# Altium project STM32F072_Platform.PrjPcb
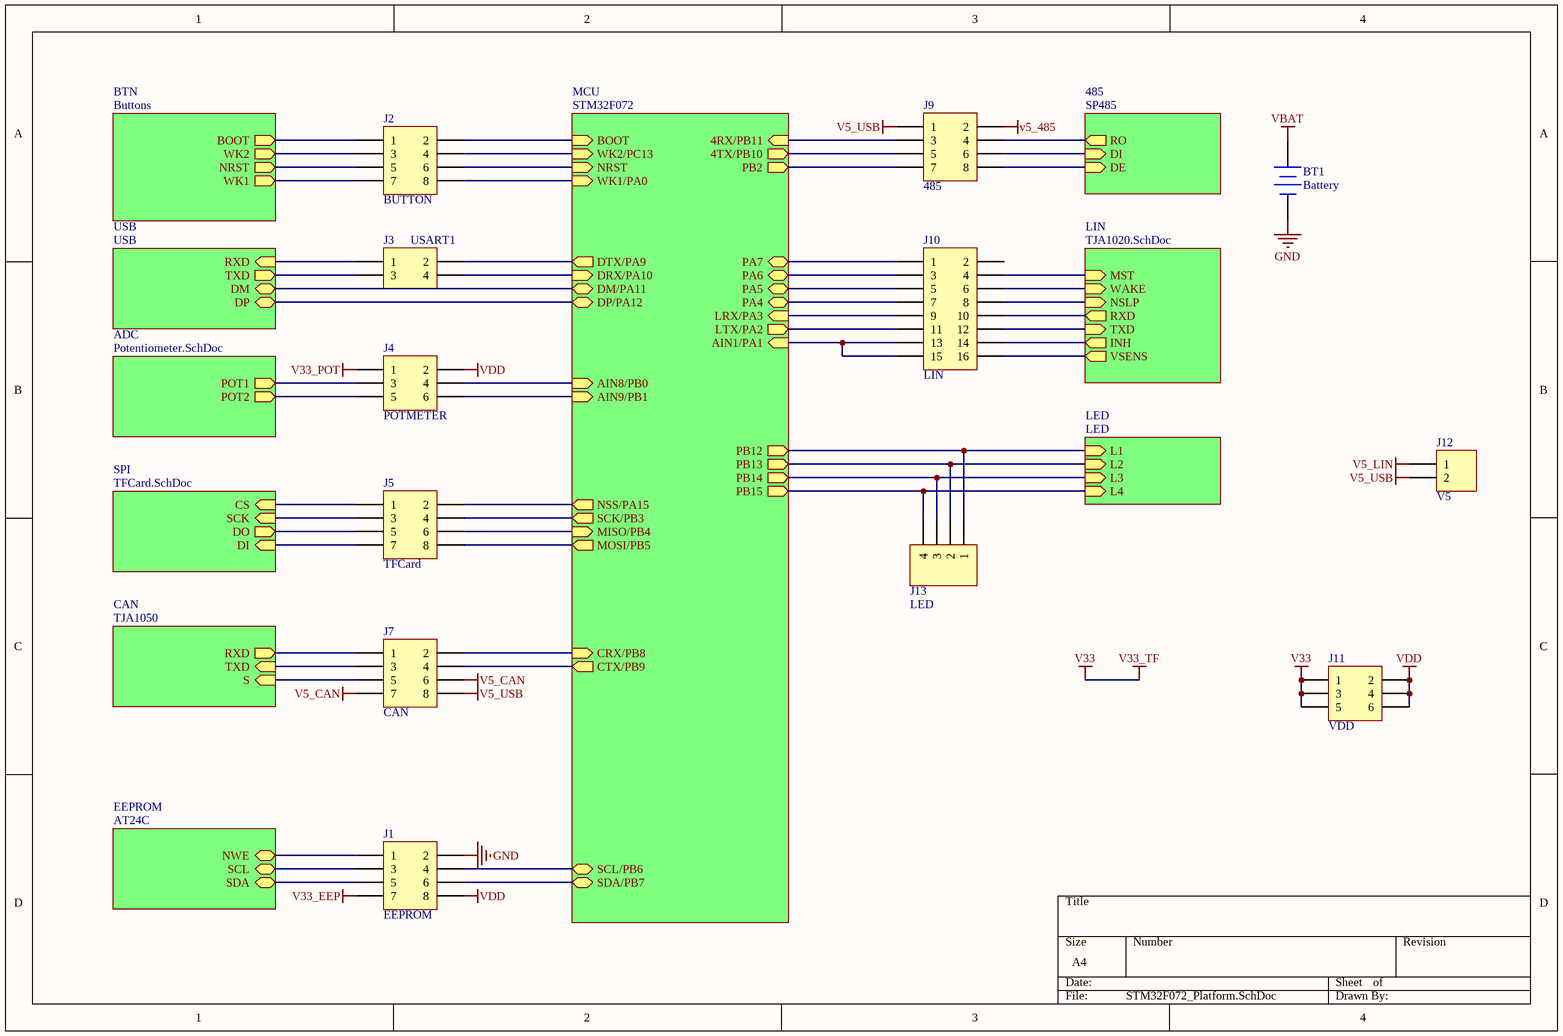
[diagram p0: STM32F072_Platform.SchDoc]
11 sheets, 126 parts. Net scope: hierarchical (ports join the sheet entries above them; power ports are global).
Board files: Outline.PcbDoc, PCB_A0.PcbDoc
Sheets:
  STM32F072_Platform.SchDoc
    MCU = STM32F072.SchDoc
    485 = SP485.SchDoc
    CAN = TJA1050.SchDoc
    SPI = TFCard.SchDoc
    EEPROM = AT24C.SchDoc
    BTN = Buttons.SchDoc
    USB = USB.SchDoc
    ADC = Potentiometer.SchDoc
    LIN = TJA1020.SchDoc
    LED = LED.SchDoc

## Sheet STM32F072_Platform.SchDoc
size A4

### Parts
BT1  Battery  [CR1220]
J1  EEPROM  [HDR2X4]
J2  BUTTON  [HDR2X4]
J3  USART1  [HDR2X2]
J4  POTMETER  [HDR2X3]
J5  TFCard  [HDR2X4]
J7  CAN  [HDR2X4]
J9  485  [HDR2X4]
J10  LIN  [HDR2X8]
J11  VDD  [HDR2X3]
J12  V5  [HDR1X2]
J13  LED  [HDR2X2]

### Sub-sheets
485 = SP485: RO (out), DI (in), DE (in)
ADC = Potentiometer.SchDoc: POT1 (out), POT2 (out)
BTN = Buttons: NRST (out), BOOT (out), WK1 (out), WK2 (out)
CAN = TJA1050: S (in), TXD (in), RXD (out)
EEPROM = AT24C: SCL, SDA, NWE
LED = LED: L1 (in), L2 (in), L3 (in), L4 (in)
LIN = TJA1020.SchDoc: TXD (in), RXD (out), NSLP (in), WAKE (in), INH (out), MST (in), VSENS (out)
MCU = STM32F072: SCL/PB6, SDA/PB7, NRST (in), BOOT (in), WK1/PA0 (in), WK2/PC13 (in), DM/PA11, DP/PA12, DRX/PA10 (in), DTX/PA9 (out), AIN8/PB0 (in), AIN9/PB1 (in), NSS/PA15 (out), SCK/PB3 (out), MOSI/PB5 (out), MISO/PB4 (in), CTX/PB9 (out), CRX/PB8 (in), 4TX/PB10 (out), 4RX/PB11 (in), LTX/PA2 (out), LRX/PA3 (in), PA4, AIN1/PA1 (in), PA5, PA6, PA7, PB2 (out), PB12 (out), PB13 (out), PB14 (out), PB15 (out)
SPI = TFCard.SchDoc: CS (in), SCK (in), DI (in), DO (out)
USB = USB: DM, DP, TXD (out), RXD (in)

### Nets
GND: BT1.2(-) J1.2
v5_485: J9.2
V5_CAN: J7.6 J7.7
V5_LIN: J12.1
V5_USB: J7.8 J9.1 J12.2
V33: J11.1 J11.3 J11.5  [also labelled V33_TF]
V33_EEP: J1.7
V33_POT: J4.1
VBAT: BT1.1(+)
VDD: J1.8 J4.2 J11.2 J11.4 J11.6
485_RX/PB11: J9.3 ; sheet MCU/4RX/PB11
485_TX/PB10: J9.5 ; sheet MCU/4TX/PB10
ADC_IN8/PB0: J4.4 ; sheet MCU/AIN8/PB0
ADC_IN9/PB1: J4.6 ; sheet MCU/AIN9/PB1
BOOT: J2.1 ; sheet BTN/BOOT
BOOT0: J2.2 ; sheet MCU/BOOT
CAN_RX/PB8: J7.2 ; sheet MCU/CRX/PB8
CAN_RXD: J7.1 ; sheet CAN/RXD
CAN_TX/PB9: J7.4 ; sheet MCU/CTX/PB9
CAN_TXD: J7.3 ; sheet CAN/TXD
CS: J5.1 ; sheet SPI/CS
DBG_RX/PA10: J3.4 ; sheet MCU/DRX/PA10
DBG_TX/PA9: J3.2 ; sheet MCU/DTX/PA9
DI: J5.7 ; sheet SPI/DI
DM: sheet MCU/DM/PA11, sheet USB/DM
DO: J5.5 ; sheet SPI/DO
DP: sheet MCU/DP/PA12, sheet USB/DP
EEP_SCL/PB6: J1.4 ; sheet MCU/SCL/PB6
EEP_SDA/PB7: J1.6 ; sheet MCU/SDA/PB7
LIN_RX/PA3: J10.9 ; sheet MCU/LRX/PA3
LIN_TX/PA2: J10.11 ; sheet MCU/LTX/PA2
NRST: J2.6 ; sheet MCU/NRST
NSLP: J10.8 ; sheet LIN/NSLP
NWE: J1.1 ; sheet EEPROM/NWE
PA1: J10.13 J10.15 ; sheet MCU/AIN1/PA1
PA4: J10.7 ; sheet MCU/PA4
PA5: J10.5 ; sheet MCU/PA5
PA6: J10.3 ; sheet MCU/PA6
PA7: J10.1 ; sheet MCU/PA7
PB2: J9.7 ; sheet MCU/PB2
PB12: J13.1 ; sheet MCU/PB12, sheet LED/L1
PB13: J13.2 ; sheet MCU/PB13, sheet LED/L2
PB14: J13.3 ; sheet MCU/PB14, sheet LED/L3
PB15: J13.4 ; sheet MCU/PB15, sheet LED/L4
RESET: J2.5 ; sheet BTN/NRST
S: J7.5 ; sheet CAN/S
SCK: J5.3 ; sheet SPI/SCK
SCL: J1.3 ; sheet EEPROM/SCL
SDA: J1.5 ; sheet EEPROM/SDA
SPI_MISO/PB4: J5.6 ; sheet MCU/MISO/PB4
SPI_MOSI/PB5: J5.8 ; sheet MCU/MOSI/PB5
SPI_NSS/PA15: J5.2 ; sheet MCU/NSS/PA15
SPI_SCK/PB3: J5.4 ; sheet MCU/SCK/PB3
WK1: J2.7 ; sheet BTN/WK1
WK2: J2.3 ; sheet BTN/WK2
WKUP1/PA0: J2.8 ; sheet MCU/WK1/PA0
WKUP2/PC13: J2.4 ; sheet MCU/WK2/PC13
NetC20_2: J4.3 ; sheet ADC/POT1
NetC21_2: J4.5 ; sheet ADC/POT2
NetJ3_1: J3.1 ; sheet USB/RXD
NetJ3_3: J3.3 ; sheet USB/TXD
NetJ9_4: J9.4 ; sheet 485/RO
NetJ9_6: J9.6 ; sheet 485/DI
NetJ9_8: J9.8 ; sheet 485/DE
NetJ10_4: J10.4 ; sheet LIN/MST
NetJ10_6: J10.6 ; sheet LIN/WAKE
NetJ10_10: J10.10 ; sheet LIN/RXD
NetJ10_12: J10.12 ; sheet LIN/TXD
NetJ10_14: J10.14 ; sheet LIN/INH
NetJ10_16: J10.16 ; sheet LIN/VSENS

Not connected (* = marked no-connect by the designer): J10 2

### Library data of the parts
BT1 = Battery: Multicell Battery; Published: 24-Mar-1999; LatestRevisionDate: 17-Jul-2002; LatestRevisionNote: Re-released for DXP Platform.; PackageReference: BAT-2; Publisher: Altium Limited; PackageDescription: Battery; 2 Leads
J1 J2 J5 J7 J9 = Header 4X2: Header, 4-Pin, Dual row; LatestRevisionDate: 17-Jul-2002; LatestRevisionNote: Re-released for DXP Platform.; Publisher: Altium Limited
J3 = Header 2X2: Header, 2-Pin, Dual row; LatestRevisionDate: 17-Jul-2002; LatestRevisionNote: Re-released for DXP Platform.; Publisher: Altium Limited
J4 = Header 3X2: POT; LatestRevisionDate: 17-Jul-2002; LatestRevisionNote: Re-released for DXP Platform.; Publisher: Altium Limited
J10 = Header 8X2: Header, 8-Pin, Dual row; LatestRevisionDate: 17-Jul-2002; LatestRevisionNote: Re-released for DXP Platform.; Publisher: Altium Limited
J11 = Header 3X2: Header, 3-Pin, Dual row; LatestRevisionDate: 17-Jul-2002; LatestRevisionNote: Re-released for DXP Platform.; Publisher: Altium Limited
J12 = Header 2: Header, 2-Pin; LatestRevisionDate: 17-Jul-2002; LatestRevisionNote: Re-released for DXP Platform.; Publisher: Altium Limited
J13 = Header 4: Header, 4-Pin; LatestRevisionDate: 17-Jul-2002; LatestRevisionNote: Re-released for DXP Platform.; Publisher: Altium Limited

## Sheet STM32F072.SchDoc
size A4
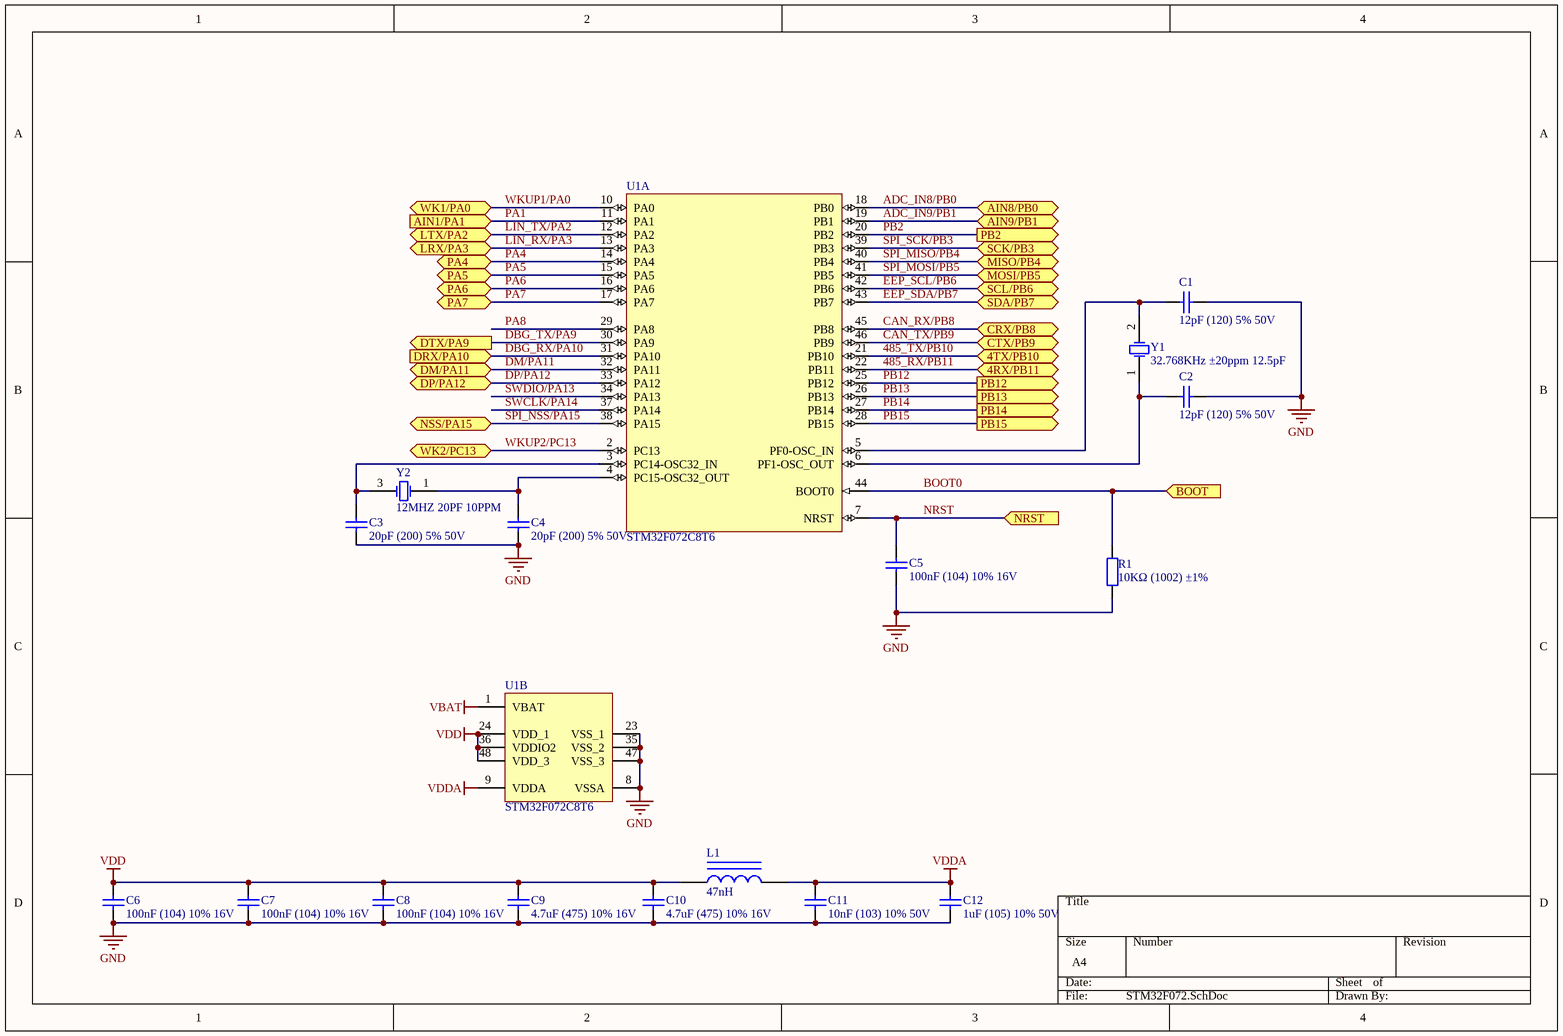
[diagram p1: STM32F072.SchDoc]

### Parts
C1  12pF (120) 5% 50V  [0402_C]
C2  12pF (120) 5% 50V  [0402_C]
C3  20pF (200) 5% 50V  [0402_C]
C4  20pF (200) 5% 50V  [0402_C]
C5  100nF (104) 10% 16V  [0402_C]
C6  100nF (104) 10% 16V  [0402_C]
C7  100nF (104) 10% 16V  [0402_C]
C8  100nF (104) 10% 16V  [0402_C]
C9  4.7uF (475) 10% 16V  [0603_C]
C10  4.7uF (475) 10% 16V  [0603_C]
C11  10nF (103) 10% 50V  [0402_C]
C12  1uF (105) 10% 50V  [0603_C]
L1  47nH  [0603_L]
R1  10KΩ (1002) ±1%  [0603_R]
U1  STM32F072C8T6  [LQFP-48_7x7x05P]  (parts A,B of 2)
Y1  32.768KHz ±20ppm 12.5pF  [SMD-3215_2P FC - 135]
Y2  12MHZ 20PF 10PPM  [SMD-3225_4P]

### Ports
4RX/PB11, 4TX/PB10, AIN1/PA1 (in), AIN8/PB0, AIN9/PB1, BOOT (in), CRX/PB8, CTX/PB9, DM/PA11, DP/PA12, DRX/PA10 (in), DTX/PA9 (out), LRX/PA3, LTX/PA2, MISO/PB4, MOSI/PB5, NRST (in), NSS/PA15, PA4, PA5, PA6, PA7, PB2 (out), PB12 (out), PB13 (out), PB14 (out), PB15 (out), SCK/PB3, SCL/PB6, SDA/PB7, WK1/PA0, WK2/PC13

### Nets
GND: C1.2 C2.2 C3.1 C4.1 C5.1 C6.1 C7.1 C8.1 C9.1 C10.1 C11.2 C12.2 R1.1 U1.8(VSSA) U1.23(VSS_1) U1.35(VSS_2) U1.47(VSS_3)
VBAT: U1.1(VBAT)
VDD: C6.2 C7.2 C8.2 C9.2 C10.2 L1.1 U1.24(VDD_1) U1.36(VDDIO2) U1.48(VDD_3)
VDDA: C11.1 C12.1 L1.2 U1.9(VDDA)
485_RX/PB11: U1.22(PB11) ; port 4RX/PB11
485_TX/PB10: U1.21(PB10) ; port 4TX/PB10
ADC_IN8/PB0: U1.18(PB0) ; port AIN8/PB0
ADC_IN9/PB1: U1.19(PB1) ; port AIN9/PB1
BOOT0: R1.2 U1.44(BOOT0) ; port BOOT
CAN_RX/PB8: U1.45(PB8) ; port CRX/PB8
CAN_TX/PB9: U1.46(PB9) ; port CTX/PB9
DBG_RX/PA10: U1.31(PA10) ; port DRX/PA10
DBG_TX/PA9: U1.30(PA9) ; port DTX/PA9
DM/PA11: U1.32(PA11) ; port DM/PA11  [project net DM]
DP/PA12: U1.33(PA12) ; port DP/PA12  [project net DP]
EEP_SCL/PB6: U1.42(PB6) ; port SCL/PB6
EEP_SDA/PB7: U1.43(PB7) ; port SDA/PB7
LIN_RX/PA3: U1.13(PA3) ; port LRX/PA3
LIN_TX/PA2: U1.12(PA2) ; port LTX/PA2
NRST: C5.2 U1.7(NRST) ; port NRST
PA1: U1.11(PA1) ; port AIN1/PA1
PA4: U1.14(PA4) ; port PA4
PA5: U1.15(PA5) ; port PA5
PA6: U1.16(PA6) ; port PA6
PA7: U1.17(PA7) ; port PA7
PA8: U1.29(PA8)
PB2: U1.20(PB2) ; port PB2
PB12: U1.25(PB12) ; port PB12
PB13: U1.26(PB13) ; port PB13
PB14: U1.27(PB14) ; port PB14
PB15: U1.28(PB15) ; port PB15
SPI_MISO/PB4: U1.40(PB4) ; port MISO/PB4
SPI_MOSI/PB5: U1.41(PB5) ; port MOSI/PB5
SPI_NSS/PA15: U1.38(PA15) ; port NSS/PA15
SPI_SCK/PB3: U1.39(PB3) ; port SCK/PB3
SWCLK/PA14: U1.37(PA14)
SWDIO/PA13: U1.34(PA13)
WKUP1/PA0: U1.10(PA0) ; port WK1/PA0
WKUP2/PC13: U1.2(PC13) ; port WK2/PC13
NetC1_1: C1.1 U1.5(PF0-OSC_IN) Y1.2(OSC2)
NetC2_1: C2.1 U1.6(PF1-OSC_OUT) Y1.1(OSC1)
NetC3_2: C3.2 U1.3(PC14-OSC32_IN) Y2.3(OSC2)
NetC4_2: C4.2 U1.4(PC15-OSC32_OUT) Y2.1(OSC1)

### Library data of the parts
C1 C2 = 0402 12pF (120) 5% 50V: 贴片电容; ComponentLink1Description: 供应商链接; ComponentLink1URL: http://www.szlcsc.com/product/details_1899.html; Package: 0402; Supplier: LC; SuppliersPartNumber: C1547
C3 C4 = 0402 20pF (200) 5% 50V: 贴片电容; ComponentLink1Description: 供应商链接; ComponentLink1URL: http://www.szlcsc.com/product/details_1906.html; Package: 0402; Supplier: LC; SuppliersPartNumber: C1554
C5-C8 = 0402 100nF (104) 10% 16V: 贴片电容; ComponentLink1Description: 供应商链接; ComponentLink1URL: http://www.szlcsc.com/product/details_1877.html; Package: 0402; Supplier: LC; SuppliersPartNumber: C1525
C9 C10 = 0603 4.7uF (475) 10% 16V: 贴片电容; ComponentLink1Description: 供应商链接; ComponentLink1URL: http://www.szlcsc.com/product/details_20375.html; Package: 0603; Supplier: LC; SuppliersPartNumber: C19666
C11 = 0402 10nF (103) 10% 50V: 贴片电容; ComponentLink1Description: 供应商链接; ComponentLink1URL: http://www.szlcsc.com/product/details_15869.html; Package: 0402; Supplier: LC; SuppliersPartNumber: C15195
C12 = 0603 1uF (105) 10% 50V: 贴片电容; ComponentLink1Description: 供应商链接; ComponentLink1URL: http://www.szlcsc.com/product/details_16531.html; Package: 0603; Supplier: LC; SuppliersPartNumber: C15849
L1 = 0603 47nH: 贴片电感; ComponentLink1Description: 供应商链接; ComponentLink1URL: http://www.szlcsc.com/product/details_30437.html; Package: 0603; Supplier: LC; SuppliersPartNumber: C29683
R1 = 0603 10KΩ (1002) 1%: 贴片电阻; ComponentLink1Description: 供应商链接; ComponentLink1URL: http://www.szlcsc.com/product/details_26547.html; Package: 0603; Supplier: LC; SuppliersPartNumber: C25804
U1 = STM32F072C8T6: ARM; Package: LQFP-48_7x7x05P; Supplier: LC; Comment_1: STM32F072C8T6
Y1 = SMD-3215_2P 32.768KHz 20ppm 12.5pF: 贴片晶振; ComponentLink1Description: 供应商链接; ComponentLink1URL: http://www.szlcsc.com/product/details_33310.html; Package: SMD-3215_2P; Supplier: LC; SuppliersPartNumber: C32346
Y2 = SMD-3225_4P  12MHZ 20PF 10PPM: 贴片晶振; ComponentLink1Description: 供应商链接; ComponentLink1URL: http://www.szlcsc.com/product/details_9522.html; Package: SMD-3225_4P; Supplier: LC; SuppliersPartNumber: C9002

## Sheet SP485.SchDoc
size A4
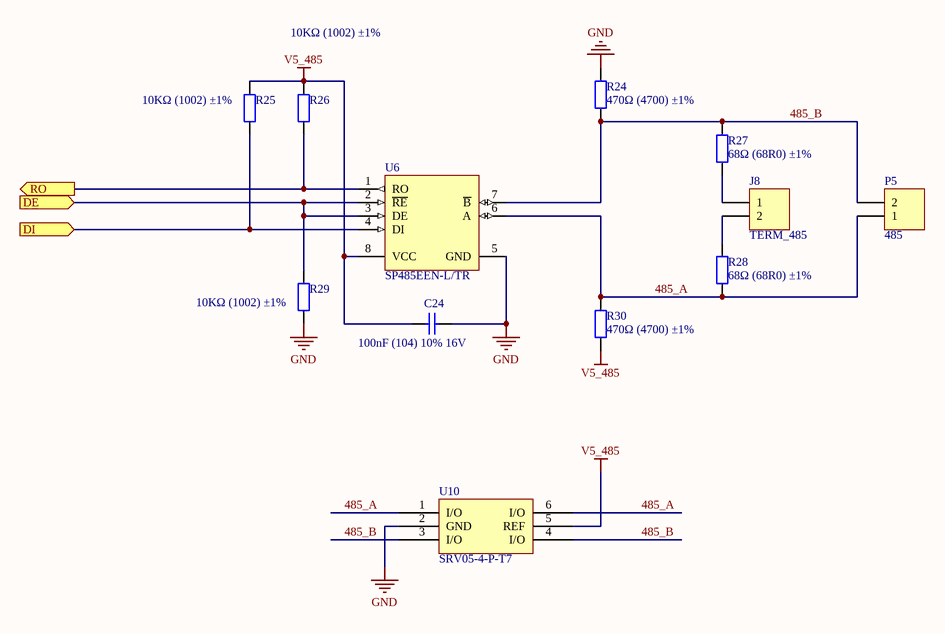
[diagram p2: SP485.SchDoc]

### Parts
C24  100nF (104) 10% 16V  [0402_C]
J8  TERM_485  [HDR1X2]
P5  485  [WJ2EDGRC-5.08-2PxxR]
R24  470Ω (4700) ±1%  [0603_R]
R25  10KΩ (1002) ±1%  [0402_R]
R26  10KΩ (1002) ±1%  [0402_R]
R27  68Ω (68R0) ±1%  [0603_R]
R28  68Ω (68R0) ±1%  [0603_R]
R29  10KΩ (1002) ±1%  [0402_R]
R30  470Ω (4700) ±1%  [0603_R]
U6  SP485EEN-L/TR  [SOIC-8_150mil]
U10  SRV05-4-P-T7  [SOT-23-6]

### Ports
DE (in), DI (in), RO (out)

### Nets
GND: C24.1 R24.2 R29.2 U6.5(GND) U10.2(GND)
v5_485: C24.2 R25.1 R26.1 R30.1 U6.8(VCC) U10.5(REF)
485_A: P5.1 R28.1 R30.2 U6.6(A) U10.1(I/O) U10.6(I/O)
485_B: P5.2 R24.1 R27.2 U6.7(~{B}) U10.3(I/O) U10.4(I/O)
NetJ8_1: J8.1 R27.1
NetJ8_2: J8.2 R28.2
NetJ9_4: R26.2 U6.1(RO) ; port RO
NetJ9_6: R25.2 U6.4(DI) ; port DI
NetJ9_8: R29.1 U6.2(~{RE}) U6.3(DE) ; port DE

### Library data of the parts
C24 = 0402 100nF (104) 10% 16V: 贴片电容; ComponentLink1Description: 供应商链接; ComponentLink1URL: http://www.szlcsc.com/product/details_1877.html; Package: 0402; Supplier: LC; SuppliersPartNumber: C1525
J8 P5 = Header 2: Header, 2-Pin; LatestRevisionDate: 17-Jul-2002; LatestRevisionNote: Re-released for DXP Platform.; Publisher: Altium Limited
R24 R30 = 0603 470Ω (4700) 1%: 贴片电阻; ComponentLink1Description: 供应商链接; ComponentLink1URL: http://www.szlcsc.com/product/details_23906.html; Package: 0603; Supplier: LC; SuppliersPartNumber: C23179
R25 R26 R29 = 0402 10KΩ (1002) 1%: 贴片电阻; ComponentLink1Description: 供应商链接; ComponentLink1URL: http://www.szlcsc.com/product/details_26487.html; Package: 0402; Supplier: LC; SuppliersPartNumber: C25744
R27 R28 = 0603 68Ω (68R0) 1%: 贴片电阻; ComponentLink1Description: 供应商链接; ComponentLink1URL: http://www.szlcsc.com/product/details_28341.html; Package: 0603; Supplier: LC; SuppliersPartNumber: C27592
U6 = SP485EEN-L/TR_[C6855]: RS-485/RS-422; ComponentLink1Description: 供应商链接; ComponentLink1URL: http://www.szlcsc.com/product/details_7327.html; Package: SOIC-8; Supplier: LC; SuppliersPartNumber: C6855
U10 = SRV05-4-P-T7_[C85364]: TVS; ComponentLink1Description: 供应商链接; ComponentLink1URL: http://www.szlcsc.com/product/details_86537.html; Package: SOT-23-6; Supplier: LC; SuppliersPartNumber: C85364

## Sheet TJA1050.SchDoc
size A4
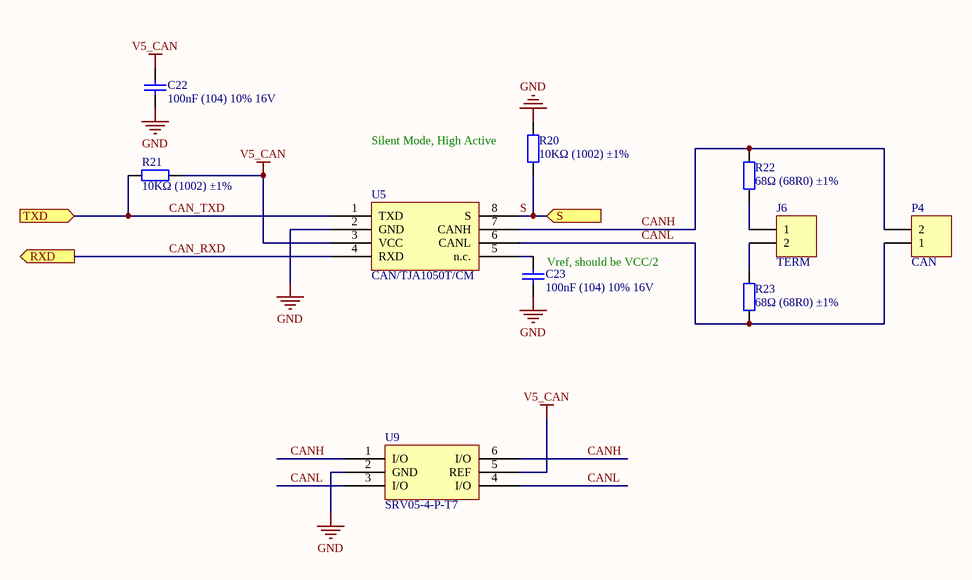
[diagram p3: TJA1050.SchDoc]

### Parts
C22  100nF (104) 10% 16V  [0402_C]
C23  100nF (104) 10% 16V  [0402_C]
J6  TERM  [HDR1X2]
P4  CAN  [WJ2EDGRC-5.08-2PxxR]
R20  10KΩ (1002) ±1%  [0402_R]
R21  10KΩ (1002) ±1%  [0402_R]
R22  68Ω (68R0) ±1%  [0603_R]
R23  68Ω (68R0) ±1%  [0603_R]
U5  CAN/TJA1050T/CM  [SOIC-8_150mil]
U9  SRV05-4-P-T7  [SOT-23-6]

### Ports
RXD (out), S (in), TXD (in)

### Nets
GND: C22.1 C23.1 R20.2 U5.2(GND) U9.2(GND)
V5_CAN: C22.2 R21.1 U5.3(VCC) U9.5(REF)
CAN_RXD: U5.4(RXD) ; port RXD
CAN_TXD: R21.2 U5.1(TXD) ; port TXD
CANH: P4.2 R22.2 U5.7(CANH) U9.1(I/O) U9.6(I/O)
CANL: P4.1 R23.1 U5.6(CANL) U9.3(I/O) U9.4(I/O)
S: R20.1 U5.8(S) ; port S
NetC23_2: C23.2 U5.5(n.c.)
NetJ6_1: J6.1 R22.1
NetJ6_2: J6.2 R23.2

### Notes on the sheet
- (near R20) Silent Mode, High Active
- (near C23) Vref, should be VCC/2

### Library data of the parts
C22 C23 = 0402 100nF (104) 10% 16V: 贴片电容; ComponentLink1Description: 供应商链接; ComponentLink1URL: http://www.szlcsc.com/product/details_1877.html; Package: 0402; Supplier: LC; SuppliersPartNumber: C1525
J6 P4 = Header 2: Header, 2-Pin; LatestRevisionDate: 17-Jul-2002; LatestRevisionNote: Re-released for DXP Platform.; Publisher: Altium Limited
R20 R21 = 0402 10KΩ (1002) 1%: 贴片电阻; ComponentLink1Description: 供应商链接; ComponentLink1URL: http://www.szlcsc.com/product/details_26487.html; Package: 0402; Supplier: LC; SuppliersPartNumber: C25744
R22 R23 = 0603 68Ω (68R0) 1%: 贴片电阻; ComponentLink1Description: 供应商链接; ComponentLink1URL: http://www.szlcsc.com/product/details_28341.html; Package: 0603; Supplier: LC; SuppliersPartNumber: C27592
U5 = CAN/TJA1050T/CM_[C6952]: CAN; ComponentLink1Description: 供应商链接; ComponentLink1URL: http://www.szlcsc.com/product/details_7424.html; Package: SOIC-8_150mil; Supplier: LC; SuppliersPartNumber: C6952
U9 = SRV05-4-P-T7_[C85364]: TVS; ComponentLink1Description: 供应商链接; ComponentLink1URL: http://www.szlcsc.com/product/details_86537.html; Package: SOT-23-6; Supplier: LC; SuppliersPartNumber: C85364

## Sheet TFCard.SchDoc
size A4
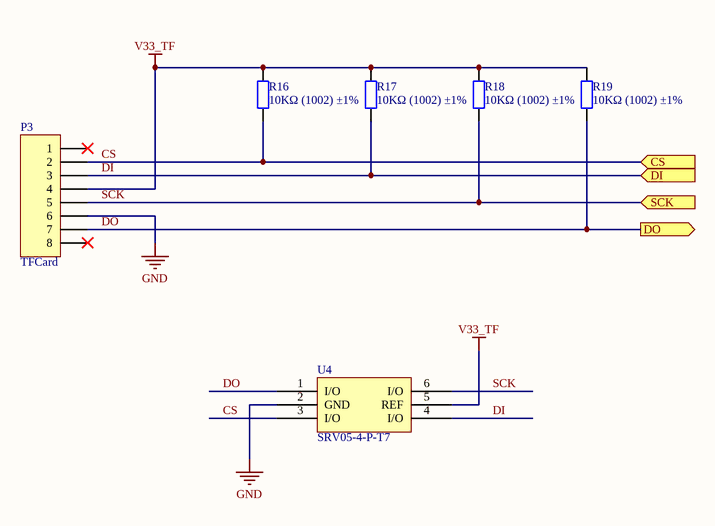
[diagram p4: TFCard.SchDoc]

### Parts
P3  TFCard  [TF002]
R16  10KΩ (1002) ±1%  [0402_R]
R17  10KΩ (1002) ±1%  [0402_R]
R18  10KΩ (1002) ±1%  [0402_R]
R19  10KΩ (1002) ±1%  [0402_R]
U4  SRV05-4-P-T7  [SOT-23-6]

### Ports
CS (in), DI (in), DO (out), SCK (in)

### Nets
GND: P3.6 U4.2(GND)
V33_TF: P3.4 R16.2 R17.2 R18.2 R19.2 U4.5(REF)  [project net V33]
CS: P3.2 R16.1 U4.3(I/O) ; port CS
DI: P3.3 R17.1 U4.4(I/O) ; port DI
DO: P3.7 R19.1 U4.1(I/O) ; port DO
SCK: P3.5 R18.1 U4.6(I/O) ; port SCK

Not connected (* = marked no-connect by the designer): P3 1* 8*

### Library data of the parts
P3 = Header 8: Header, 8-Pin; LatestRevisionDate: 17-Jul-2002; LatestRevisionNote: Re-released for DXP Platform.; Publisher: Altium Limited
R16-R19 = 0402 10KΩ (1002) 1%: 贴片电阻; ComponentLink1Description: 供应商链接; ComponentLink1URL: http://www.szlcsc.com/product/details_26487.html; Package: 0402; Supplier: LC; SuppliersPartNumber: C25744
U4 = SRV05-4-P-T7_[C85364]: TVS; ComponentLink1Description: 供应商链接; ComponentLink1URL: http://www.szlcsc.com/product/details_86537.html; Package: SOT-23-6; Supplier: LC; SuppliersPartNumber: C85364

## Sheet AT24C.SchDoc
size A4
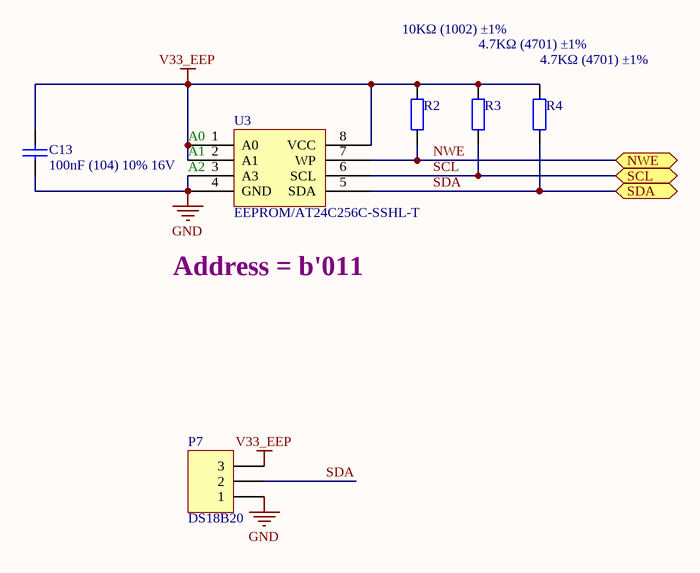
[diagram p5: AT24C.SchDoc]

### Parts
C13  100nF (104) 10% 16V  [0402_C]
P7  DS18B20  [TO-92A]
R2  10KΩ (1002) ±1%  [0402_R]
R3  4.7KΩ (4701) ±1%  [0402_R]
R4  4.7KΩ (4701) ±1%  [0402_R]
U3  EEPROM/AT24C256C-SSHL-T  [SOIC-8_150mil]

### Ports
NWE, SCL, SDA

### Nets
GND: C13.1 P7.1 U3.3(A3) U3.4(GND)
V33_EEP: C13.2 P7.3 R2.2 R3.2 R4.2 U3.1(A0) U3.2(A1) U3.8(VCC)
NWE: R2.1 U3.7(WP) ; port NWE
SCL: R3.1 U3.6(SCL) ; port SCL
SDA: P7.2 R4.1 U3.5(SDA) ; port SDA

### Notes on the sheet
- (near U3) A2
- (near U3) A0
- (near U3) A1
- Address = b'011

### Library data of the parts
C13 = 0402 100nF (104) 10% 16V: 贴片电容; ComponentLink1Description: 供应商链接; ComponentLink1URL: http://www.szlcsc.com/product/details_1877.html; Package: 0402; Supplier: LC; SuppliersPartNumber: C1525
P7 = Header 3: Header, 3-Pin; LatestRevisionDate: 17-Jul-2002; LatestRevisionNote: Re-released for DXP Platform.; Publisher: Altium Limited
R2 = 0402 10KΩ (1002) 1%: 贴片电阻; ComponentLink1Description: 供应商链接; ComponentLink1URL: http://www.szlcsc.com/product/details_26487.html; Package: 0402; Supplier: LC; SuppliersPartNumber: C25744
R3 R4 = 0402 4.7KΩ (4701) 1%: 贴片电阻; ComponentLink1Description: 供应商链接; ComponentLink1URL: http://www.szlcsc.com/product/details_26643.html; Package: 0402; Supplier: LC; SuppliersPartNumber: C25900
U3 = EEPROM/AT24C256C-SSHL-T_[C6482]: EEPROM; ComponentLink1Description: 供应商链接; ComponentLink1URL: http://www.szlcsc.com/product/details_6947.html; Package: SOIC-8_150mil; Supplier: LC; SuppliersPartNumber: C6482

## Sheet Buttons.SchDoc
size A4
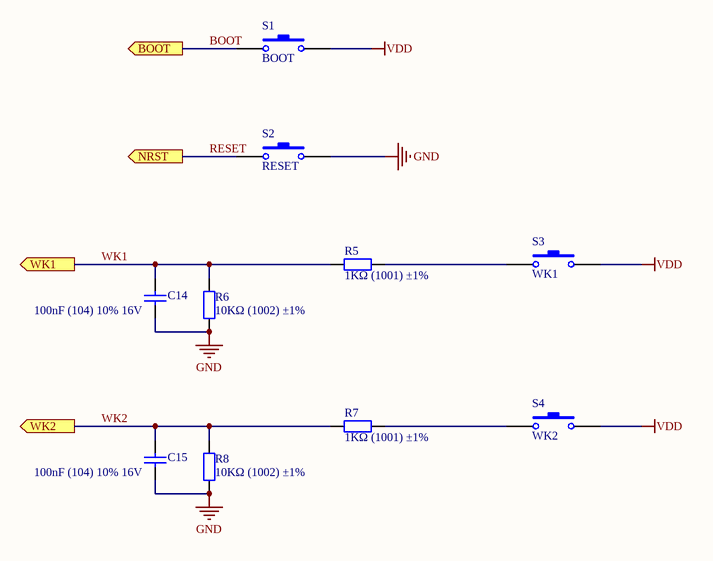
[diagram p6: Buttons.SchDoc]

### Parts
C14  100nF (104) 10% 16V  [0402_C]
C15  100nF (104) 10% 16V  [0402_C]
R5  1KΩ (1001) ±1%  [0402_R]
R6  10KΩ (1002) ±1%  [0402_R]
R7  1KΩ (1001) ±1%  [0402_R]
R8  10KΩ (1002) ±1%  [0402_R]
S1  BOOT  [SW-6x6]
S2  RESET  [SW-6x6]
S3  WK1  [SW-6x6]
S4  WK2  [SW-6x6]

### Ports
BOOT (out), NRST (out), WK1 (out), WK2 (out)

### Nets
GND: C14.1 C15.1 R6.1 R8.1 S2.2
VDD: S1.2 S3.2 S4.2
BOOT: S1.1 ; port BOOT
RESET: S2.1 ; port NRST
WK1: C14.2 R5.1 R6.2 ; port WK1
WK2: C15.2 R7.1 R8.2 ; port WK2
NetR5_2: R5.2 S3.1
NetR7_2: R7.2 S4.1

### Library data of the parts
C14 C15 = 0402 100nF (104) 10% 16V: 贴片电容; ComponentLink1Description: 供应商链接; ComponentLink1URL: http://www.szlcsc.com/product/details_1877.html; Package: 0402; Supplier: LC; SuppliersPartNumber: C1525
R5 R7 = 0402 1KΩ (1001) 1%: 贴片电阻; ComponentLink1Description: 供应商链接; ComponentLink1URL: http://www.szlcsc.com/product/details_12256.html; Package: 0402; Supplier: LC; SuppliersPartNumber: C11702
R6 R8 = 0402 10KΩ (1002) 1%: 贴片电阻; ComponentLink1Description: 供应商链接; ComponentLink1URL: http://www.szlcsc.com/product/details_26487.html; Package: 0402; Supplier: LC; SuppliersPartNumber: C25744
S1-S4 = SW-PB: Switch; Published: 24-Mar-1999; LatestRevisionDate: 17-Jul-2002; LatestRevisionNote: Re-released for DXP Platform.; PackageReference: SPST-2; Publisher: Altium Limited; PackageDescription: Switch; 2 Leads

## Sheet USB.SchDoc
size A4
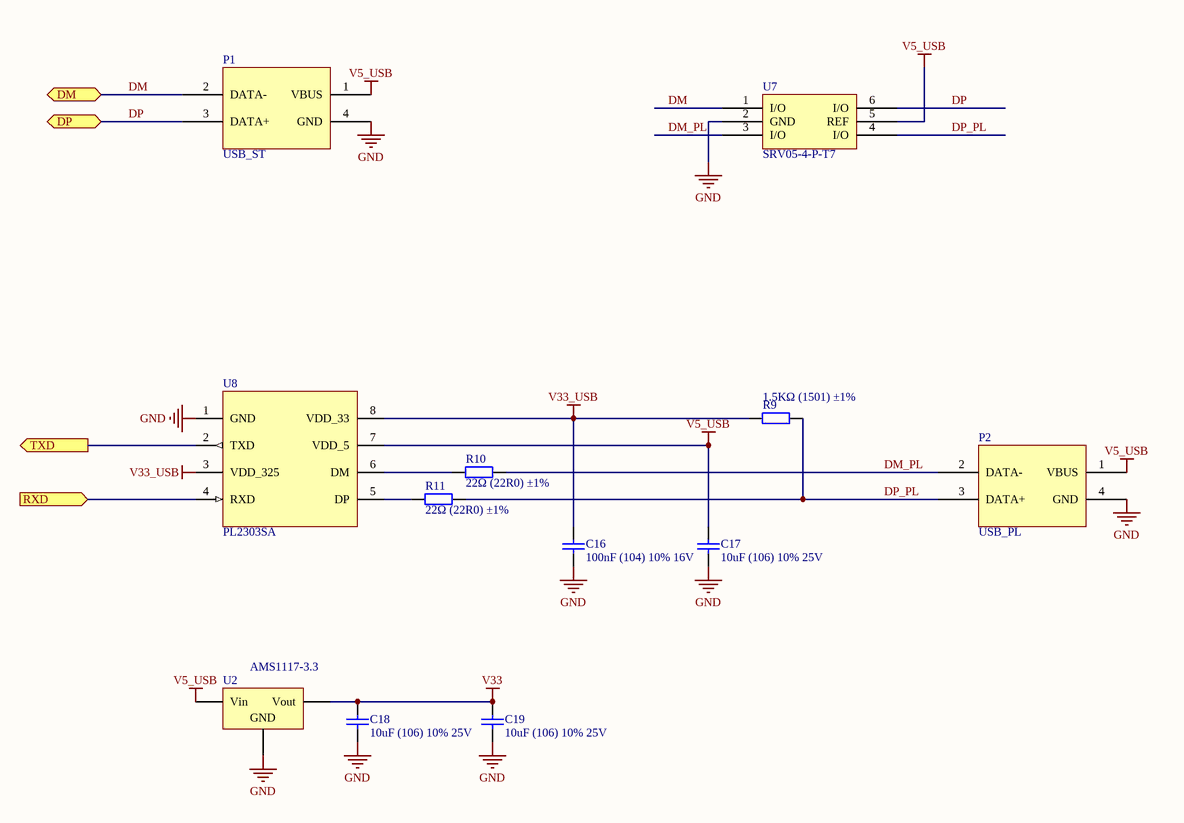
[diagram p7: USB.SchDoc]

### Parts
C16  100nF (104) 10% 16V  [0402_C]
C17  10uF (106) 10% 25V  [0805_C]
C18  10uF (106) 10% 25V  [0805_C]
C19  10uF (106) 10% 25V  [0805_C]
P1  USB_ST  [USB-B/Female]
P2  USB_PL  [USB-B/Female]
R9  1.5KΩ (1501) ±1%  [0402_R]
R10  22Ω (22R0) ±1%  [0402_R]
R11  22Ω (22R0) ±1%  [0402_R]
U2  AMS1117-3.3  [SOT-223]
U7  SRV05-4-P-T7  [SOT-23-6]
U8  PL2303SA  [SOP-8_150mil]

### Ports
DM, DP, RXD (in), TXD (out)

### Nets
GND: C16.1 C17.1 C18.1 C19.1 P1.4(GND) P2.4(GND) U2.1(GND) U7.2(GND) U8.1(GND)
V5_USB: C17.2 P1.1(VBUS) P2.1(VBUS) U2.3(Vin) U7.5(REF) U8.7(VDD_5)
V33: C18.2 C19.2 U2.2(Vout)
V33_USB: C16.2 R9.2 U8.3(VDD_325) U8.8(VDD_33)
DM: P1.2(DATA-) U7.1(I/O) ; port DM
DM_PL: P2.2(DATA-) R10.2 U7.3(I/O)
DP: P1.3(DATA+) U7.6(I/O) ; port DP
DP_PL: P2.3(DATA+) R9.1 R11.2 U7.4(I/O)
NetJ3_1: U8.4(RXD) ; port RXD
NetJ3_3: U8.2(TXD) ; port TXD
NetR10_1: R10.1 U8.6(DM)
NetR11_1: R11.1 U8.5(DP)

### Library data of the parts
C16 = 0402 100nF (104) 10% 16V: 贴片电容; ComponentLink1Description: 供应商链接; ComponentLink1URL: http://www.szlcsc.com/product/details_1877.html; Package: 0402; Supplier: LC; SuppliersPartNumber: C1525
C17-C19 = 0805 10uF (106) 10% 25V: 贴片电容; ComponentLink1Description: 供应商链接; ComponentLink1URL: http://www.szlcsc.com/product/details_16532.html; Package: 0805; Supplier: LC; SuppliersPartNumber: C15850
P1 P2 = USB-B/Female
R9 = 0402 1.5KΩ (1501) 1%: 贴片电阻; ComponentLink1Description: 供应商链接; ComponentLink1URL: http://www.szlcsc.com/product/details_26610.html; Package: 0402; Supplier: LC; SuppliersPartNumber: C25867
R10 R11 = 0402 22Ω (22R0) 1%: 贴片电阻; ComponentLink1Description: 供应商链接; ComponentLink1URL: http://www.szlcsc.com/product/details_25835.html; Package: 0402; Supplier: LC; SuppliersPartNumber: C25092
U2 = SOT-223 AMS1117-3.3: 低压差线性稳压(LDO); ComponentLink1Description: 供应商链接; ComponentLink1URL: http://www.szlcsc.com/product/details_6652.html; Package: SOT-223; Supplier: LC; SuppliersPartNumber: C6186
U7 = SRV05-4-P-T7_[C85364]: TVS; ComponentLink1Description: 供应商链接; ComponentLink1URL: http://www.szlcsc.com/product/details_86537.html; Package: SOT-23-6; Supplier: LC; SuppliersPartNumber: C85364

## Sheet Potentiometer.SchDoc
size A4
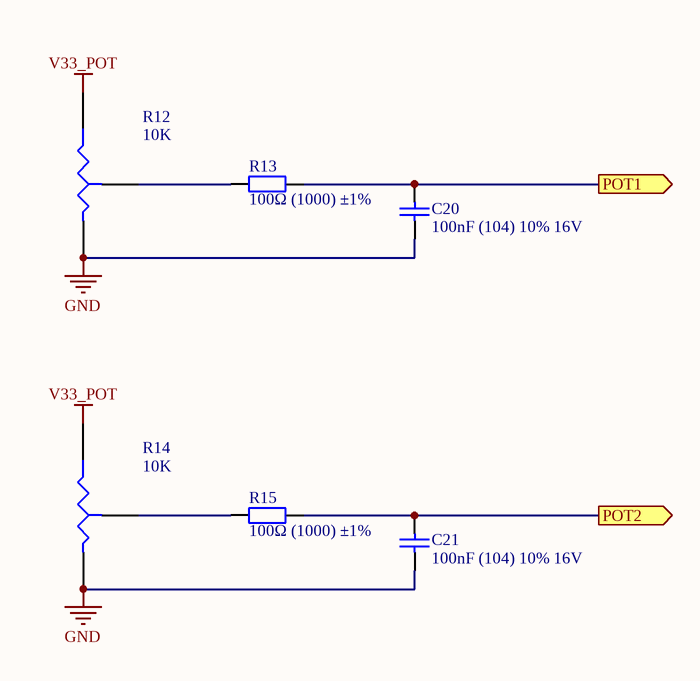
[diagram p8: Potentiometer.SchDoc]

### Parts
C20  100nF (104) 10% 16V  [0402_C]
C21  100nF (104) 10% 16V  [0402_C]
R12  10K  [AIN16]
R13  100Ω (1000) ±1%  [0402_R]
R14  10K  [AIN16]
R15  100Ω (1000) ±1%  [0402_R]

### Ports
POT1 (out), POT2 (out)

### Nets
GND: C20.1 C21.1 R12.1(A) R14.1(A)
V33_POT: R12.2(B) R14.2(B)
NetC20_2: C20.2 R13.2 ; port POT1
NetC21_2: C21.2 R15.2 ; port POT2
NetR12_3: R12.3(TAP) R13.1
NetR14_3: R14.3(TAP) R15.1

### Library data of the parts
C20 C21 = 0402 100nF (104) 10% 16V: 贴片电容; ComponentLink1Description: 供应商链接; ComponentLink1URL: http://www.szlcsc.com/product/details_1877.html; Package: 0402; Supplier: LC; SuppliersPartNumber: C1525
R12 R14 = Res Tap: Tapped Resistor; Sim Note: Enter the Resistance value and the set point into parameter fields.; Set Position: 0.5; Value: 1K; Published: 24-Mar-1999; LatestRevisionDate: 17-Jul-2002; LatestRevisionNote: Re-released for DXP Platform.; PackageReference: VR3; Publisher: Altium Limited; PackageDescription: Variable Resistor, Thru-Hole; 3 Leads
R13 R15 = 0402 100Ω (1000) 1%: 贴片电阻; ComponentLink1Description: 供应商链接; ComponentLink1URL: http://www.szlcsc.com/product/details_25819.html; Package: 0402; Supplier: LC; SuppliersPartNumber: C25076

## Sheet TJA1020.SchDoc
size A4
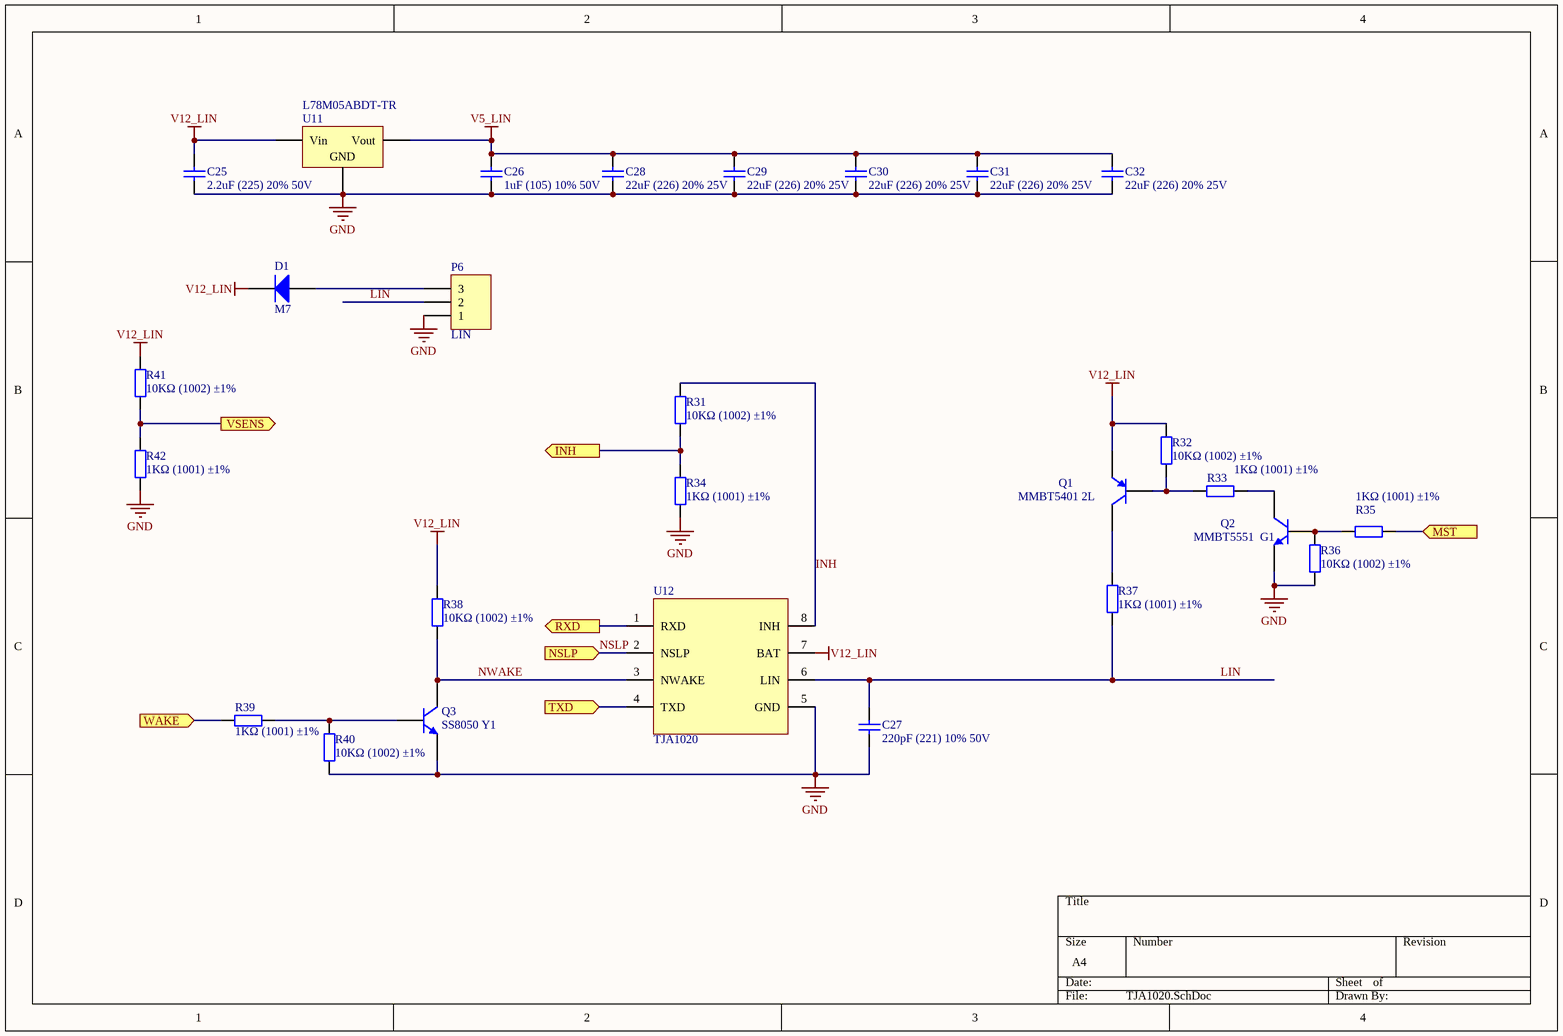
[diagram p9: TJA1020.SchDoc]

### Parts
C25  2.2uF (225) 20% 50V  [0805_C]
C26  1uF (105) 10% 50V  [0603_C]
C27  220pF (221) 10% 50V  [0402_C]
C28  22uF (226) 20% 25V  [0805_C]
C29  22uF (226) 20% 25V  [0805_C]
C30  22uF (226) 20% 25V  [0805_C]
C31  22uF (226) 20% 25V  [0805_C]
C32  22uF (226) 20% 25V  [0805_C]
D1  M7  [SMA(DO-214AC)_S1]
P6  LIN  [WJ2EDGRC-5.08-3PxxR]
Q1  MMBT5401 2L  [SOT-23(SOT-23-3)]
Q2  MMBT5551  G1  [SOT-23(SOT-23-3)]
Q3  SS8050 Y1  [SOT-23(SOT-23-3)]
R31  10KΩ (1002) ±1%  [0402_R]
R32  10KΩ (1002) ±1%  [0402_R]
R33  1KΩ (1001) ±1%  [0402_R]
R34  1KΩ (1001) ±1%  [0402_R]
R35  1KΩ (1001) ±1%  [0402_R]
R36  10KΩ (1002) ±1%  [0402_R]
R37  1KΩ (1001) ±1%  [0805_R]
R38  10KΩ (1002) ±1%  [0402_R]
R39  1KΩ (1001) ±1%  [0402_R]
R40  10KΩ (1002) ±1%  [0402_R]
R41  10KΩ (1002) ±1%  [0402_R]
R42  1KΩ (1001) ±1%  [0402_R]
U11  L78M05ABDT-TR  [TO-252-2-180]
U12  TJA1020  [SOP-8_150mil]

### Ports
INH (out), MST (in), NSLP (in), RXD (out), TXD (in), VSENS (out), WAKE (in)

### Nets
GND: C25.1 C26.1 C27.1 C28.1 C29.2 C30.2 C31.2 C32.1 P6.1 Q2.2(E) Q3.2(E) R34.1 R36.1 R40.1 R42.1 U11.2(GND) U12.5(GND)
V5_LIN: C26.2 C28.2 C29.1 C30.1 C31.1 C32.2 U11.3(Vout)
V12_LIN: C25.2 D1.2(K) Q1.2(E) R32.2 R38.2 R41.2 U11.1(Vin) U12.7(BAT)
INH: R31.2 U12.8(INH)
LIN: C27.2 P6.2 R37.1 U12.6(LIN)
NSLP: U12.2(NSLP) ; port NSLP
NWAKE: Q3.3(C) R38.1 U12.3(NWAKE)
NetD1_1: D1.1(A) P6.3
NetJ10_4: R35.1 ; port MST
NetJ10_6: R39.2 ; port WAKE
NetJ10_10: U12.1(RXD) ; port RXD
NetJ10_12: U12.4(TXD) ; port TXD
NetJ10_14: R31.1 R34.2 ; port INH
NetJ10_16: R41.1 R42.2 ; port VSENS
NetQ1_1: Q1.1(B) R32.1 R33.2
NetQ1_3: Q1.3(C) R37.2
NetQ2_1: Q2.1(B) R35.2 R36.2
NetQ2_3: Q2.3(C) R33.1
NetQ3_1: Q3.1(B) R39.1 R40.2

### Library data of the parts
C25 = 0805 2.2uF (225) 20% 50V: 贴片电容; ComponentLink1Description: 供应商链接; ComponentLink1URL: http://www.szlcsc.com/product/details_50225.html; Package: 0805; Supplier: LC; SuppliersPartNumber: C49217
C26 = 0603 1uF (105) 10% 50V: 贴片电容; ComponentLink1Description: 供应商链接; ComponentLink1URL: http://www.szlcsc.com/product/details_16531.html; Package: 0603; Supplier: LC; SuppliersPartNumber: C15849
C27 = 0402 220pF (221) 10% 50V: 贴片电容; ComponentLink1Description: 供应商链接; ComponentLink1URL: http://www.szlcsc.com/product/details_1882.html; Package: 0402; Supplier: LC; SuppliersPartNumber: C1530
C28-C32 = 0805 22uF (226) 20% 25V: 贴片电容; ComponentLink1Description: 供应商链接; ComponentLink1URL: http://www.szlcsc.com/product/details_46786.html; Package: 0805; Supplier: LC; SuppliersPartNumber: C45783
D1 = SMA(DO-214AC) M7: 二极管; 备注: 1N4007 4007 编号C2464 已经停售, 使用新物料编号C95872; ComponentLink1Description: 供应商链接; ComponentLink1URL: http://www.szlcsc.com/product/details_2841.html; Package: SMA(DO-214AC); Supplier: LC; SuppliersPartNumber: C95872
P6 = Header 3: Header, 3-Pin; LatestRevisionDate: 17-Jul-2002; LatestRevisionNote: Re-released for DXP Platform.; Publisher: Altium Limited
Q1 = SOT-23 MMBT5401 2L: 三极管; ComponentLink1Description: 供应商链接; ComponentLink1URL: http://www.szlcsc.com/product/details_8818.html; Package: SOT-23; Supplier: LC; SuppliersPartNumber: C8326
Q2 = SOT-23 MMBT5551  G1: 三极管; ComponentLink1Description: 供应商链接; ComponentLink1URL: http://www.szlcsc.com/product/details_2502.html; Package: SOT-23; Supplier: LC; SuppliersPartNumber: C2145
Q3 = SOT-23 SS8050 Y1: 三极管; ComponentLink1Description: 供应商链接; ComponentLink1URL: http://www.szlcsc.com/product/details_2507.html; Package: SOT-23; Supplier: LC; SuppliersPartNumber: C2150
R31 R32 R36 R38 R40 R41 = 0402 10KΩ (1002) 1%: 贴片电阻; ComponentLink1Description: 供应商链接; ComponentLink1URL: http://www.szlcsc.com/product/details_26487.html; Package: 0402; Supplier: LC; SuppliersPartNumber: C25744
R33-R35 R39 R42 = 0402 1KΩ (1001) 1%: 贴片电阻; ComponentLink1Description: 供应商链接; ComponentLink1URL: http://www.szlcsc.com/product/details_12256.html; Package: 0402; Supplier: LC; SuppliersPartNumber: C11702
R37 = 0805 1KΩ (1001) 1%: 贴片电阻; ComponentLink1Description: 供应商链接; ComponentLink1URL: http://www.szlcsc.com/product/details_18201.html; Package: 0805; Supplier: LC; SuppliersPartNumber: C17513
U11 = TO-252-2 L78M05ABDT-TR: 低压差线性稳压(LDO); ComponentLink1Description: 供应商链接; ComponentLink1URL: http://www.szlcsc.com/product/details_59107.html; Package: TO-252-2; Supplier: LC; SuppliersPartNumber: C58069

## Sheet LED.SchDoc
size A4
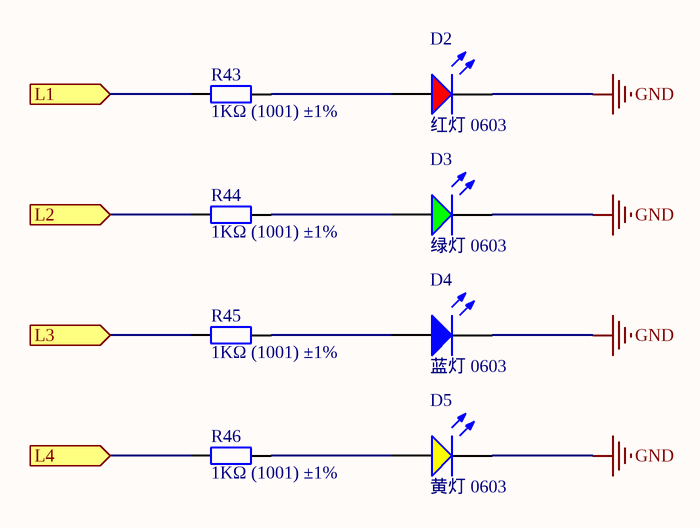
[diagram p10: LED.SchDoc]

### Parts
D2  红灯 0603  [0603_LED_S1]
D3  绿灯 0603  [0603_LED_S1]
D4  蓝灯 0603  [0603_LED_S1]
D5  黄灯 0603  [0603_LED_S1]
R43  1KΩ (1001) ±1%  [0402_R]
R44  1KΩ (1001) ±1%  [0402_R]
R45  1KΩ (1001) ±1%  [0402_R]
R46  1KΩ (1001) ±1%  [0402_R]

### Ports
L1 (in), L2 (in), L3 (in), L4 (in)

### Nets
GND: D2.K D3.K D4.K D5.K
PB12: R43.1 ; port L1
PB13: R44.1 ; port L2
PB14: R45.1 ; port L3
PB15: R46.1 ; port L4
NetD2_A: D2.A R43.2
NetD3_A: D3.A R44.2
NetD4_A: D4.A R45.2
NetD5_A: D5.A R46.2

### Library data of the parts
D2 = 0603 红灯: 发光二极管; ComponentLink1Description: 供应商链接; ComponentLink1URL: http://www.szlcsc.com/product/details_2659.html; Package: 0603; Supplier: LC; SuppliersPartNumber: C2286
D3 = 0603 绿灯: 发光二极管; ComponentLink1Description: 供应商链接; ComponentLink1URL: http://www.szlcsc.com/product/details_73152.html; Package: 0603; Supplier: LC; SuppliersPartNumber: C72043
D4 = 0603 蓝灯: 发光二极管; ComponentLink1Description: 供应商链接; ComponentLink1URL: http://www.szlcsc.com/product/details_73150.html; Package: 0603; Supplier: LC; SuppliersPartNumber: C72041
D5 = 0603 黄灯: 发光二极管; ComponentLink1Description: 供应商链接; ComponentLink1URL: http://www.szlcsc.com/product/details_73147.html; Package: 0603; Supplier: LC; SuppliersPartNumber: C72038
R43-R46 = 0402 1KΩ (1001) 1%: 贴片电阻; ComponentLink1Description: 供应商链接; ComponentLink1URL: http://www.szlcsc.com/product/details_12256.html; Package: 0402; Supplier: LC; SuppliersPartNumber: C11702

## Nets that join several sheets
GND: STM32F072_Platform (BT1.2 J1.2), STM32F072 (17 pins), SP485 (5 pins), TJA1050 (5 pins), TFCard (P3.6 U4.2), AT24C (C13.1 P7.1 U3.3 U3.4), Buttons (5 pins), USB (9 pins), Potentiometer (C20.1 C21.1 R12.1 R14.1), TJA1020 (17 pins), LED (D2.K D3.K D4.K D5.K)
v5_485: STM32F072_Platform (J9.2), SP485 (6 pins)
V5_CAN: STM32F072_Platform (J7.6 J7.7), TJA1050 (C22.2 R21.1 U5.3 U9.5)
V5_LIN: STM32F072_Platform (J12.1), TJA1020 (7 pins)
V5_USB: STM32F072_Platform (J7.8 J9.1 J12.2), USB (6 pins)
V33: STM32F072_Platform (J11.1 J11.3 J11.5), TFCard (6 pins), USB (C18.2 C19.2 U2.2)
V33_EEP: STM32F072_Platform (J1.7), AT24C (8 pins)
V33_POT: STM32F072_Platform (J4.1), Potentiometer (R12.2 R14.2)
VBAT: STM32F072_Platform (BT1.1), STM32F072 (U1.1)
VDD: STM32F072_Platform (5 pins), STM32F072 (9 pins), Buttons (S1.2 S3.2 S4.2)
485_RX/PB11: STM32F072_Platform (J9.3), STM32F072 (U1.22)
485_TX/PB10: STM32F072_Platform (J9.5), STM32F072 (U1.21)
ADC_IN8/PB0: STM32F072_Platform (J4.4), STM32F072 (U1.18)
ADC_IN9/PB1: STM32F072_Platform (J4.6), STM32F072 (U1.19)
BOOT: STM32F072_Platform (J2.1), Buttons (S1.1)
BOOT0: STM32F072_Platform (J2.2), STM32F072 (R1.2 U1.44)
CAN_RX/PB8: STM32F072_Platform (J7.2), STM32F072 (U1.45)
CAN_RXD: STM32F072_Platform (J7.1), TJA1050 (U5.4)
CAN_TX/PB9: STM32F072_Platform (J7.4), STM32F072 (U1.46)
CAN_TXD: STM32F072_Platform (J7.3), TJA1050 (R21.2 U5.1)
CS: STM32F072_Platform (J5.1), TFCard (P3.2 R16.1 U4.3)
DBG_RX/PA10: STM32F072_Platform (J3.4), STM32F072 (U1.31)
DBG_TX/PA9: STM32F072_Platform (J3.2), STM32F072 (U1.30)
DI: STM32F072_Platform (J5.7), TFCard (P3.3 R17.1 U4.4)
DM: STM32F072 (U1.32), USB (P1.2 U7.1)
DO: STM32F072_Platform (J5.5), TFCard (P3.7 R19.1 U4.1)
DP: STM32F072 (U1.33), USB (P1.3 U7.6)
EEP_SCL/PB6: STM32F072_Platform (J1.4), STM32F072 (U1.42)
EEP_SDA/PB7: STM32F072_Platform (J1.6), STM32F072 (U1.43)
LIN_RX/PA3: STM32F072_Platform (J10.9), STM32F072 (U1.13)
LIN_TX/PA2: STM32F072_Platform (J10.11), STM32F072 (U1.12)
NetC20_2: STM32F072_Platform (J4.3), Potentiometer (C20.2 R13.2)
NetC21_2: STM32F072_Platform (J4.5), Potentiometer (C21.2 R15.2)
NetJ3_1: STM32F072_Platform (J3.1), USB (U8.4)
NetJ3_3: STM32F072_Platform (J3.3), USB (U8.2)
NetJ9_4: STM32F072_Platform (J9.4), SP485 (R26.2 U6.1)
NetJ9_6: STM32F072_Platform (J9.6), SP485 (R25.2 U6.4)
NetJ9_8: STM32F072_Platform (J9.8), SP485 (R29.1 U6.2 U6.3)
NetJ10_4: STM32F072_Platform (J10.4), TJA1020 (R35.1)
NetJ10_6: STM32F072_Platform (J10.6), TJA1020 (R39.2)
NetJ10_10: STM32F072_Platform (J10.10), TJA1020 (U12.1)
NetJ10_12: STM32F072_Platform (J10.12), TJA1020 (U12.4)
NetJ10_14: STM32F072_Platform (J10.14), TJA1020 (R31.1 R34.2)
NetJ10_16: STM32F072_Platform (J10.16), TJA1020 (R41.1 R42.2)
NRST: STM32F072_Platform (J2.6), STM32F072 (C5.2 U1.7)
NSLP: STM32F072_Platform (J10.8), TJA1020 (U12.2)
NWE: STM32F072_Platform (J1.1), AT24C (R2.1 U3.7)
PA1: STM32F072_Platform (J10.13 J10.15), STM32F072 (U1.11)
PA4: STM32F072_Platform (J10.7), STM32F072 (U1.14)
PA5: STM32F072_Platform (J10.5), STM32F072 (U1.15)
PA6: STM32F072_Platform (J10.3), STM32F072 (U1.16)
PA7: STM32F072_Platform (J10.1), STM32F072 (U1.17)
PB2: STM32F072_Platform (J9.7), STM32F072 (U1.20)
PB12: STM32F072_Platform (J13.1), STM32F072 (U1.25), LED (R43.1)
PB13: STM32F072_Platform (J13.2), STM32F072 (U1.26), LED (R44.1)
PB14: STM32F072_Platform (J13.3), STM32F072 (U1.27), LED (R45.1)
PB15: STM32F072_Platform (J13.4), STM32F072 (U1.28), LED (R46.1)
RESET: STM32F072_Platform (J2.5), Buttons (S2.1)
S: STM32F072_Platform (J7.5), TJA1050 (R20.1 U5.8)
SCK: STM32F072_Platform (J5.3), TFCard (P3.5 R18.1 U4.6)
SCL: STM32F072_Platform (J1.3), AT24C (R3.1 U3.6)
SDA: STM32F072_Platform (J1.5), AT24C (P7.2 R4.1 U3.5)
SPI_MISO/PB4: STM32F072_Platform (J5.6), STM32F072 (U1.40)
SPI_MOSI/PB5: STM32F072_Platform (J5.8), STM32F072 (U1.41)
SPI_NSS/PA15: STM32F072_Platform (J5.2), STM32F072 (U1.38)
SPI_SCK/PB3: STM32F072_Platform (J5.4), STM32F072 (U1.39)
WK1: STM32F072_Platform (J2.7), Buttons (C14.2 R5.1 R6.2)
WK2: STM32F072_Platform (J2.3), Buttons (C15.2 R7.1 R8.2)
WKUP1/PA0: STM32F072_Platform (J2.8), STM32F072 (U1.10)
WKUP2/PC13: STM32F072_Platform (J2.4), STM32F072 (U1.2)